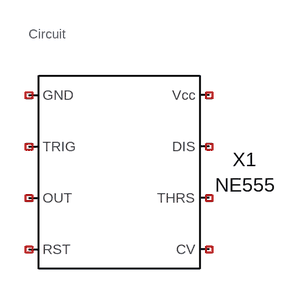
[diagram p0: schematic circuit.asc]
circuit.asc, the LTspice schematic file:
Version 4
SHEET 1 368 384
SYMBOL Misc\NE555 448 336 R0
WINDOW 0 156 -16 Center 2
WINDOW 3 156 16 Center 2
SYMATTR InstName X1
SYMATTR Value NE555
TEXT 336 164 Left 1 ;Circuit

The netlist it stands for:
* circuit.asc
XX1 NC_01 NC_02 NC_03 NC_04 NC_05 NC_06 NC_07 NC_08 NE555  ; pins GND TRIG OUT RST CV THRS DIS Vcc
* Circuit
.lib NE555.sub
.backanno
.end